# EAGLE design Leak2 (EAGLE 8.4.0)
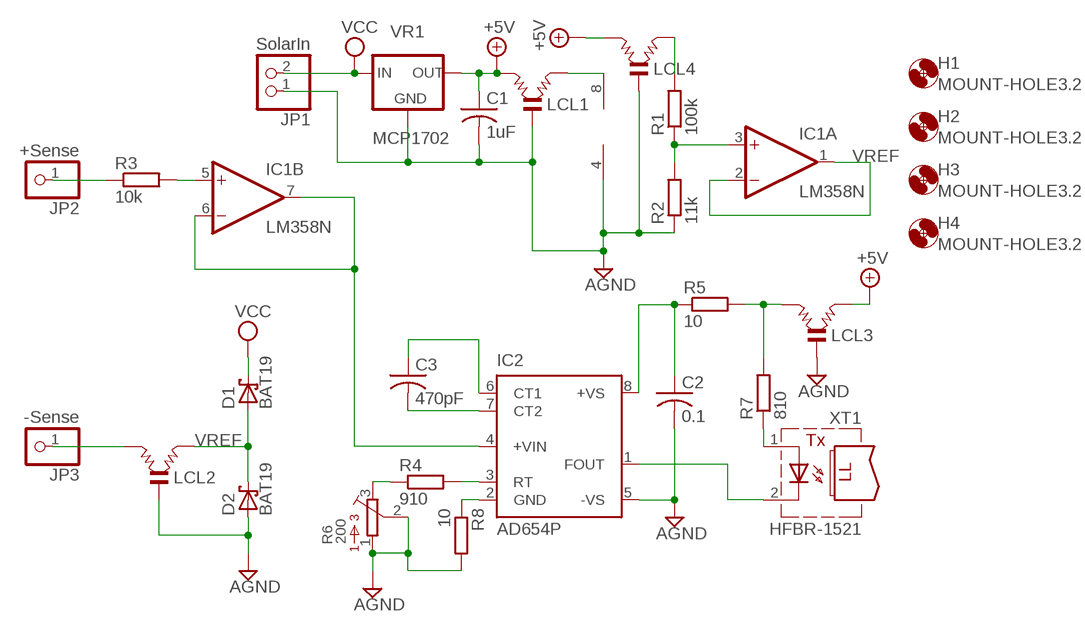
[diagram p0: schematic, sheet 1]

## Parts
C1  1uF  C-US050-035X075  [C050-035X075]
C2  0.1  C-US050-035X075  [C050-035X075]
C3  470pF  C-US050-035X075  [C050-035X075]
D1  BAT19  [DO35-10]
D2  BAT19  [DO35-10]
H1  MOUNT-HOLE3.2  [3,2]
H2  MOUNT-HOLE3.2  [3,2]
H3  MOUNT-HOLE3.2  [3,2]
H4  MOUNT-HOLE3.2  [3,2]
IC1  LM358N  [DIL08]
IC2  AD654P  [DIL08]
JP1  SolarIn  PINHD-1X2  [1X02]
JP2  +Sense  PINHD-1X1  [1X01]
JP3  -Sense  PINHD-1X1  [1X01]
LCL1  LCL  [LCL]
LCL2  LCL  [LCL]
LCL3  LCL  [LCL]
LCL4  LCL  [LCL]
R1  100k  R-EU_0204/7  [0204/7]
R2  11k  R-EU_0204/7  [0204/7]
R3  10k  R-EU_0204/7  [0204/7]
R4  910  R-EU_0204/7  [0204/7]
R5  10  R-EU_0204/7  [0204/7]
R6  200  3386-F  [3386F]
R7  810  R-EU_0204/7  [0204/7]
R8  10  R-EU_0204/7  [0204/7]
VR1  MCP1702  [TO92-]
XT1  HFBR-1521  [HFBR-15X3]

## Nets
+5V: C1.1 LCL1.1 LCL3.2 LCL4.1 VR1.1(OUT)
AGND: C1.2 C2.2 D2.A IC1.4(P:V-) IC2.5(-VS) JP1.1 LCL1.0(GND) LCL2.0(GND) LCL3.0(GND) LCL4.0(GND) R2.1 R6.1 R6.2 R8.2 VR1.3(GND)
N$1: JP2.1 R3.1
N$2: IC1.5(B:+IN) R3.2
N$3: IC1.6(B:-IN) IC1.7(B:OUT) IC2.4(+VIN)
N$4: IC1.8(P:V+) LCL1.2
N$5: IC1.3(A:+IN) R1.1 R2.2
N$6: IC2.3(RT) R4.2
N$7: JP3.1 LCL2.1
N$8: C2.1 IC2.8(+VS) R5.1
N$9: C3.2 IC2.7(CT2)
N$10: C3.1 IC2.6(CT1)
N$11: R4.1 R6.3
N$12: IC2.1(FOUT) XT1.2(C)
N$13: LCL3.1 R5.2 R7.2
N$14: R7.1 XT1.1(A)
N$15: IC2.2(GND) R8.1
N$16: LCL4.2 R1.2
VCC: D1.C JP1.2 VR1.2(IN)
VREF: D1.A D2.C IC1.1(A:OUT) IC1.2(A:-IN) LCL2.2

## Library data of the parts
C1-C3 = rcl:C-US: CAPACITOR, American symbol
D1 D2 = diode:BAT19: DIODE barrier diode
H1-H4 = holes:MOUNT-HOLE: MOUNTING HOLE with drill center marker
IC1 = linear:LM358: OP AMP
IC2 = analog-devices:AD654: Low Cost Monolithic Voltage-to-Frequency Converter
JP1 = pinhead:PINHD-1X2: PIN HEADER
JP2 JP3 = pinhead:PINHD-1X1: PIN HEADER
LCL1-LCL4 = murata-filter:LCL: FILTER
R1-R5 R7 R8 = rcl:R-EU_: RESISTOR, European symbol
R6 = BOURNS:3386-: 3386 Series 3/8" Square Trimmer
VR1 = custom_parts:MCP1702: Microchip low dropout regulator, 250mA
XT1 = fiber-optic-hp:HFBR-1521: TRANSMITTER low cost miniature fiber optic component, 5-MBd high performance link, vertical

## Board
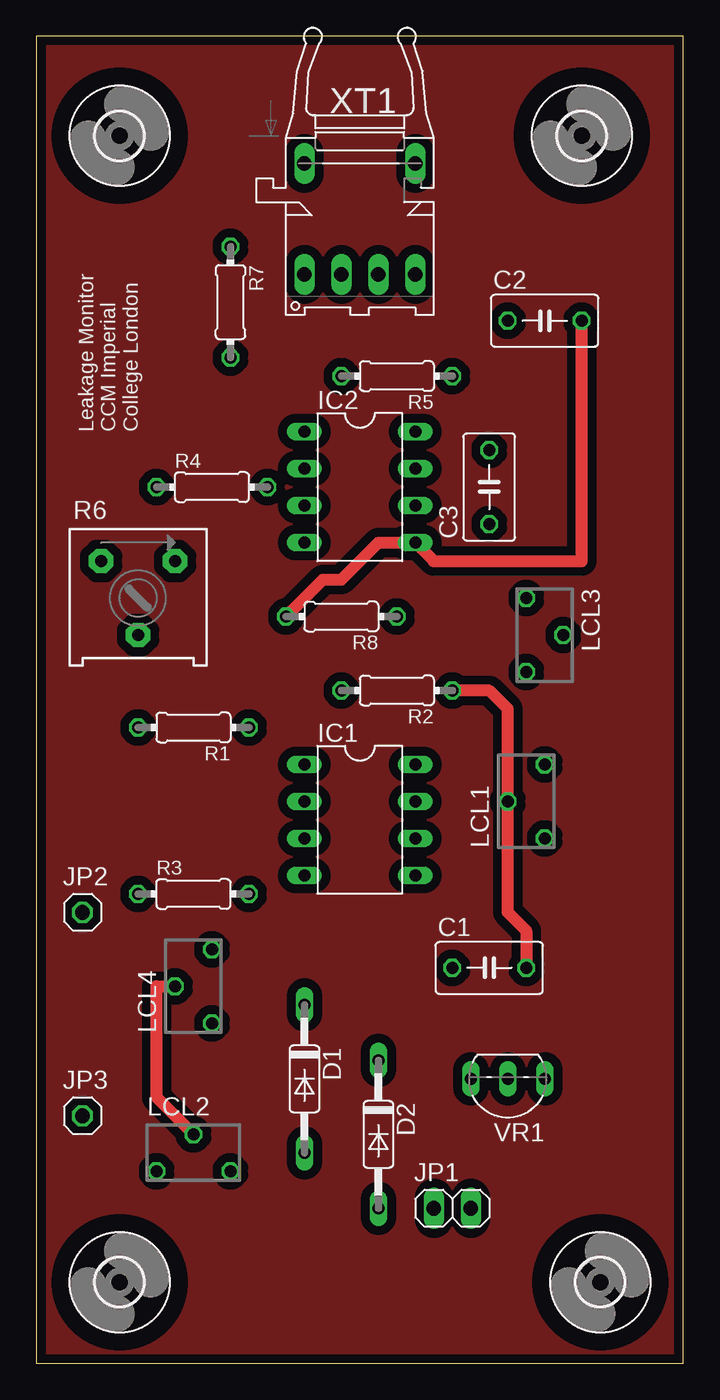
[diagram p1: board, top side]
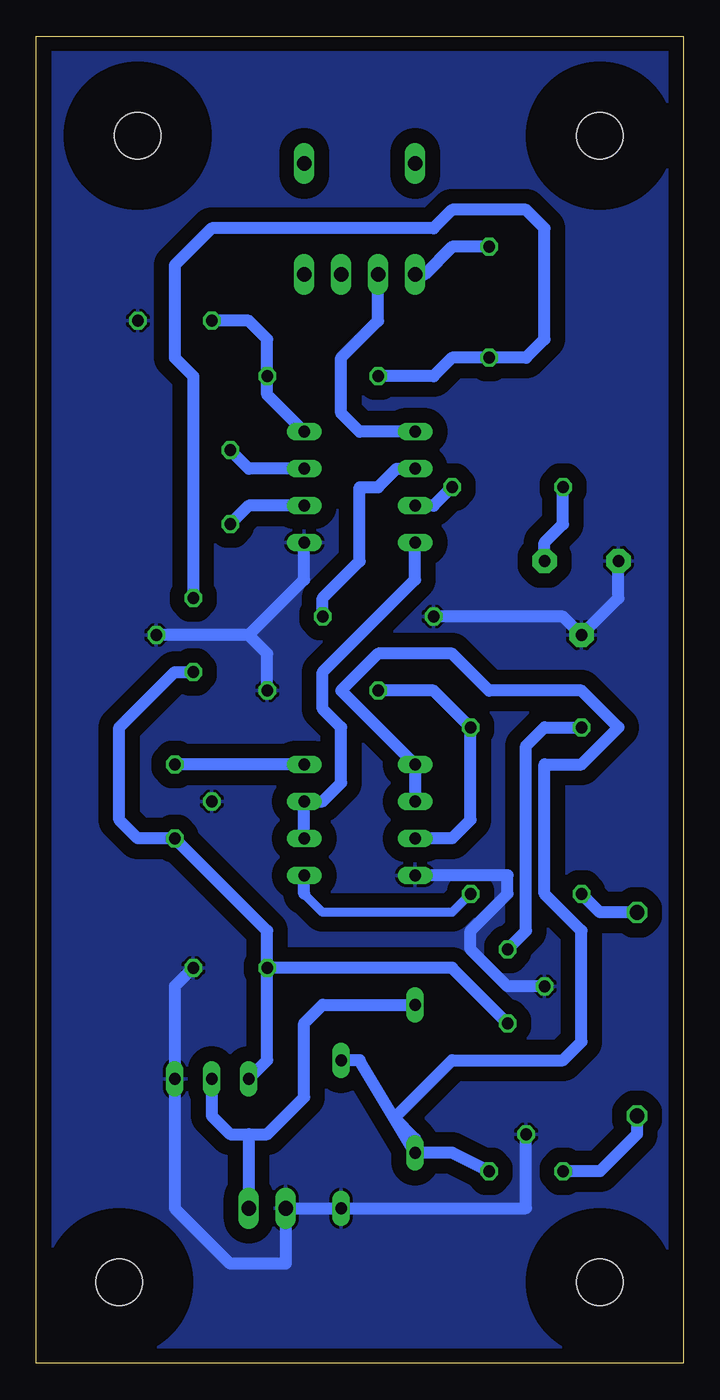
[diagram p2: board, bottom side, seen from below]

Size 44.43 x 91.11 mm. Coordinates in mm from the lower left corner, seen from the top.
Outline: 0,0 44.43,0 44.43,91.11 0,91.11 0,0
Copper layers (1*16): Top 0.035mm / dielectric 1.5mm / Bottom 0.035mm
Design rules "PCB-POOL Standard": minimum track width 0.15mm, minimum drill 0.3mm, track to track 0.15mm, track to pad 0.15mm, pad to pad 0.15mm, via to via 0.15mm, smd to smd 0.15mm, copper to edge 0.3mm, drill to drill 0.2mm, minimum pad ring 0.2mm, minimum via ring 0.15mm, stop-mask expansion 0.075mm, vias tented up to drill 0mil, thermal gap 0.2mm

### Footprints (pad centres in the part's own frame; a part is rotated, then mirrored left to right if it is on the bottom)
C050-035X075 = drill 0.813 octagon: 1 -2.54,0; 2 2.54,0
DO35-10 = drill 0.813 long: A 5.08,0; C -5.08,0
3,2 = hole 3.2: 0,0
DIL08 = drill 0.813 long: 1 -3.81,-3.81; 2 -1.27,-3.81; 3 1.27,-3.81; 4 3.81,-3.81; 5 3.81,3.81; 6 1.27,3.81; 7 -1.27,3.81; 8 -3.81,3.81
1X02 = drill 1.016 long: 1 -1.27,0; 2 1.27,0
1X01 = drill 1.016 octagon: 1 0,0
LCL = drill 0.813 octagon: 0 0,1.27; 1 -2.54,-1.27; 2 2.54,-1.27
0204/7 = drill 0.813 octagon: 1 -3.81,0; 2 3.81,0
3386F = drill 0.813 pad 1.676 octagon: 1 -2.54,2.54; 2 0,-2.54; 3 2.54,2.54
TO92- = drill 0.813 long: 1 2.54,0; 2 0,0; 3 -2.54,0
HFBR-15X3 = drill 1.016 long: 1 3.81,9.525; 2 1.27,9.525; 3 -1.27,9.525; 4 -3.81,9.525; 5 -3.81,1.905; 8 3.81,1.905

### Placement (x,y rotation side)
C1  31.11,27.14 0 top
C2  34.92,71.59 0 top
C3  31.11,60.16 90 top
D1  18.41,19.52 270 top
D2  23.49,15.71 270 top
H1  5.71,5.55 0 top
H2  38.73,5.55 0 top
H3  5.71,84.29 0 top
H4  37.46,84.29 0 top
IC1  22.22,37.3 270 top
IC2  22.22,60.16 270 top
JP1  28.57,10.63 0 top
JP2  3.17,30.95 0 top
JP3  3.17,16.98 0 top
LCL1  33.65,38.57 90 top
LCL2  10.79,14.44 0 top
LCL3  34.92,50 270 top
LCL4  10.79,25.87 90 top
R1  10.79,43.65 180 top
R2  24.76,46.19 180 top
R3  10.79,32.22 0 top
R4  12.06,60.16 0 top
R5  24.76,67.78 180 top
R6  6.98,52.54 0 top
R7  13.33,72.86 270 top
R8  20.95,51.27 180 top
VR1  32.38,19.52 180 top
XT1  22.22,84.29 180 top

### Tracks (layer width: path | path; a pad name or v marks a point on that pad's centre or on a via)
+5V
  Bottom 0.813: LCL4.1 15.87,27.14 C1.1 | C1.1 28.57,29.68 LCL1.1 37.46,36.03 38.73,37.3 38.73,43.65 34.92,47.46 LCL3.2 | VR1.1 28.57,20.79 C1.1
AGNC
  pour Top (isolate 0.61): 0.63,0.47 0.63,90.64 43.81,90.64 43.81,0.47
AGND
  Top 0.813: LCL2.0 8.25,18.25 8.25,25.87 LCL4.0 | C1.2 33.65,29.68 32.38,30.95 LCL1.0 32.38,44.92 31.11,46.19 R2.1 | R8.2 19.68,53.81 20.95,53.81 23.49,56.35 IC2.5 27.3,55.08 37.46,55.08 C2.2
  Bottom 0.813: R8.2 8.25,51.27 R6.2 4.44,52.54 R6.1 | R2.1 28.57,48.73 29.84,50 | 29.84,50 LCL3.0 | 29.84,50 26.03,53.81 IC2.5 | LCL4.0 12.06,25.87 14.6,28.41 14.6,29.68 12.06,32.22 12.06,33.49 IC1.4 | C1.2 34.92,25.87 VR1.3 34.92,10.63 31.11,6.82 27.3,6.82 JP1.1 D2.A 10.79,10.63 LCL2.0
  pour Bottom (isolate 1.016): 0.63,0.47 0.63,90.64 43.81,90.64 43.81,0.47
N$1
  Bottom 0.813: JP2.1 5.71,30.95 R3.1
N$2
  Bottom 0.61: R3.2 15.87,30.95 24.76,30.95 26.03,32.22
  Bottom 0.813: 26.03,32.22 IC1.5
N$3
  Bottom 0.813: IC1.6 IC1.7 24.76,38.57 23.49,39.84 23.49,43.65 24.76,44.92 24.76,47.46 18.41,53.81 IC2.4
N$4
  Bottom 0.813: IC1.8 LCL1.2
N$5
  Bottom 0.813: R2.2 17.14,46.19 R1.1 14.6,37.3 15.87,36.03 IC1.3
N$6
  Bottom 0.813: R4.2 17.14,58.89 IC2.3
N$7
  Bottom 0.813: JP3.1 3.17,15.71 5.71,13.17 LCL2.1
N$8
  Bottom 0.813: IC2.8 28.57,66.51 R5.1 28.57,70.32 29.84,71.59 C2.1
N$9
  Bottom 0.813: IC2.7 29.84,61.43 C3.2
N$10
  Bottom 0.813: C3.1 29.84,58.89 IC2.6
N$11
  Bottom 0.813: R6.3 9.52,56.35 8.25,57.62 R4.1
N$12
  Bottom 0.813: IC2.1 22.22,63.97 23.49,65.24 23.49,69.05 20.95,71.59 XT1.2
N$13
  Bottom 0.813: R5.2 17.14,67.78 15.87,69.05 R7.2 10.79,69.05 9.52,70.32 9.52,77.94 10.79,79.21 15.87,79.21 17.14,77.94 32.38,77.94 34.92,75.4 34.92,69.05 33.65,67.78 LCL3.1
N$14
  Bottom 0.813: XT1.1 17.77,74.77 15.87,76.67 R7.1
N$15
  Bottom 0.813: R8.1 24.76,52.54 22.22,55.08 22.22,60.16 20.95,60.16 19.68,61.43 IC2.2
N$16
  Bottom 0.813: R1.2 9.52,43.65 10.79,42.38 10.79,29.68 LCL4.2
VCC
  Bottom 0.813: 29.84,15.71 JP1.2 | D1.C 24.76,24.6 26.03,23.33 26.03,18.25 28.57,15.71 29.84,15.71 | VR1.2 32.38,16.98 31.11,15.71 29.84,15.71
VREF
  Bottom 0.813: D2.C 22.22,20.79 D1.A | D1.A 15.87,14.44 LCL2.2 | D1.A 18.41,15.41 19.87,16.87 19.75,16.98 19.68,16.98 15.87,20.79 8.25,20.79 6.98,22.06 6.98,29.68 9.52,32.22 9.52,41.11 6.98,41.11 4.44,43.65 6.98,46.19 13.33,46.19 15.87,48.73 20.95,48.73 23.49,46.19 IC1.1 IC1.2

### Text on the board
tNames: Leakage Monitor / CCM Imperial / College London